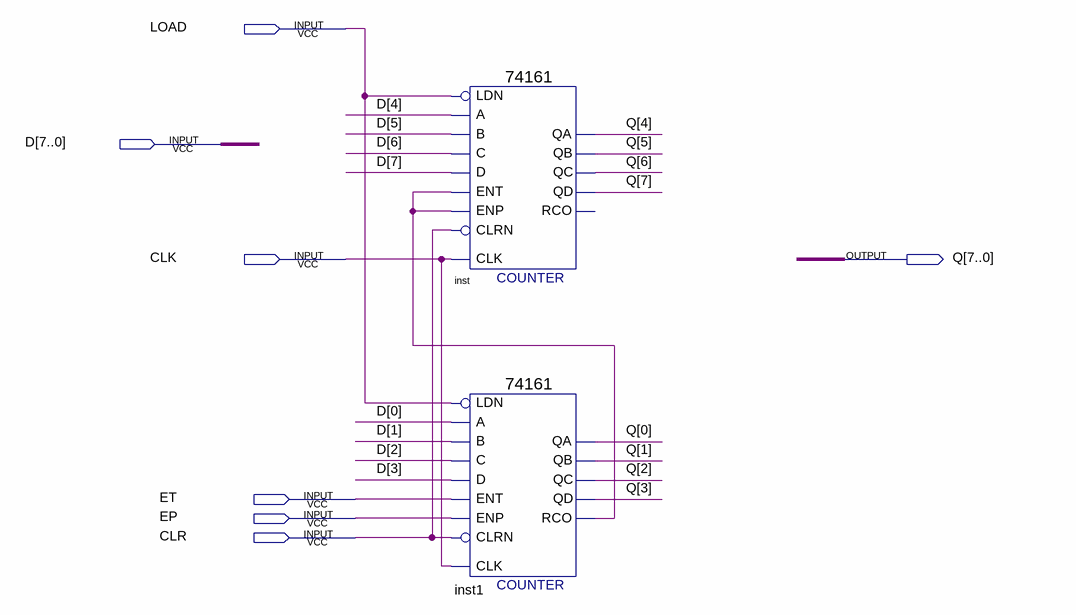
[diagram p0: schematic sheet]
// Quartus schematic uPC.bdf as structural Verilog: 2 symbols, 7 pins
module uPC (
  input  LOAD,
  input  [7:0] D,
  input  CLK,
  input  ET,
  input  EP,
  input  CLR,
  output [7:0] Q
);

  wire inst1_rco;

  \74161  inst (
    .CLRN(CLR), .CLK(CLK), .ENP(inst1_rco), .LDN(LOAD), .A(D[4]), .D(D[7]), .ENT(inst1_rco), .B(D[5]),
    .C(D[6]), .QD(Q[7]), .QC(Q[6]), .QB(Q[5]), .QA(Q[4]));  // open: RCO
  \74161  inst1 (
    .CLRN(CLR), .CLK(CLK), .ENP(EP), .LDN(LOAD), .A(D[0]), .D(D[3]), .ENT(ET), .B(D[1]), .C(D[2]), .QD(Q[3]),
    .QC(Q[2]), .QB(Q[1]), .QA(Q[0]), .RCO(inst1_rco));
endmodule
